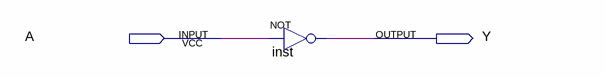
[diagram p0: schematic sheet]
// Quartus schematic CONG_NOT.bdf as structural Verilog: 1 symbols, 2 pins
module CONG_NOT (
  input  A,
  output Y
);

  not inst (Y, A);
endmodule
